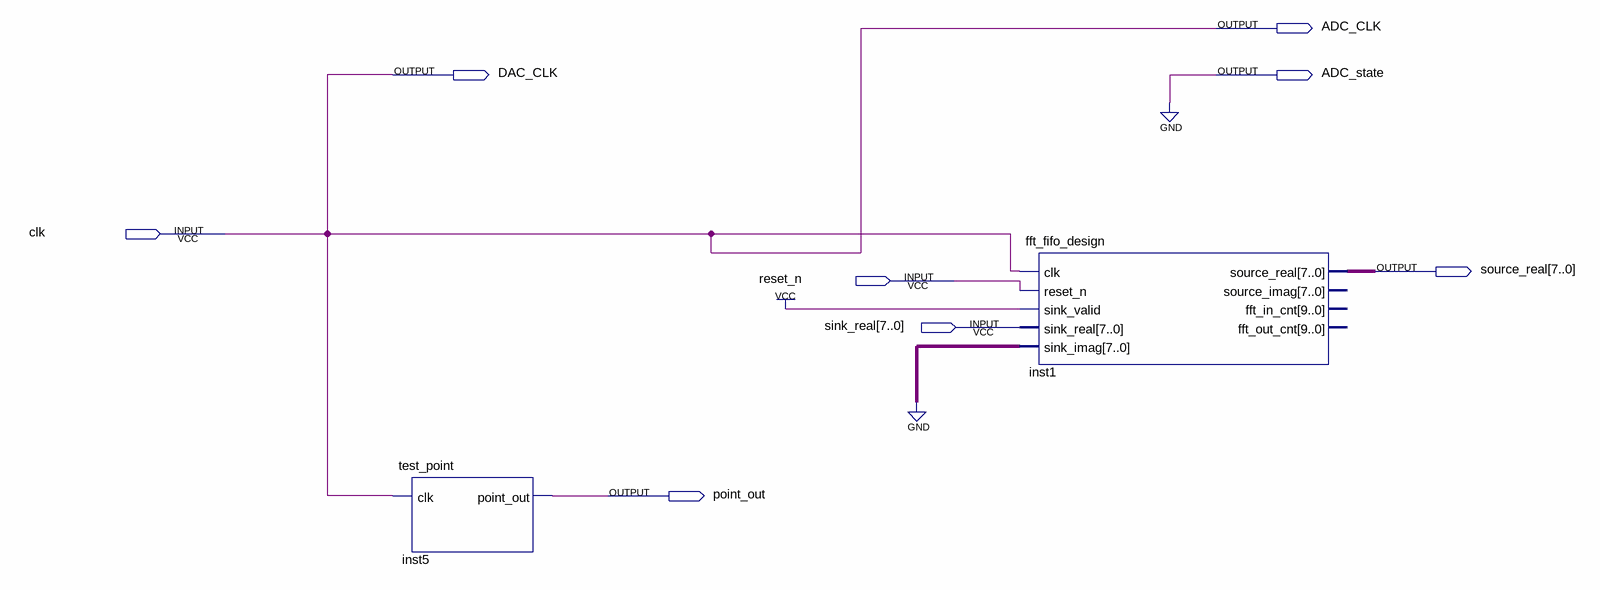
[diagram p0: schematic sheet]
// Quartus schematic fft_t.bdf as structural Verilog: 2 symbols, 8 pins
module fft_t (
  input  clk,
  input  reset_n,
  input  [7:0] sink_real,
  output ADC_CLK,
  output DAC_CLK,
  output ADC_state,
  output [7:0] source_real,
  output point_out
);

  test_point inst5 (.clk(clk), .point_out(point_out));
  fft_fifo_design inst1 (
    .clk(clk), .reset_n(reset_n), .sink_valid(1'b1), .sink_real(sink_real), .sink_imag({8{1'b0}}),
    .source_real(source_real));  // open: source_imag, fft_in_cnt, fft_out_cnt

  assign ADC_CLK = clk;
  assign ADC_state = 1'b0;
  assign DAC_CLK = clk;
endmodule
